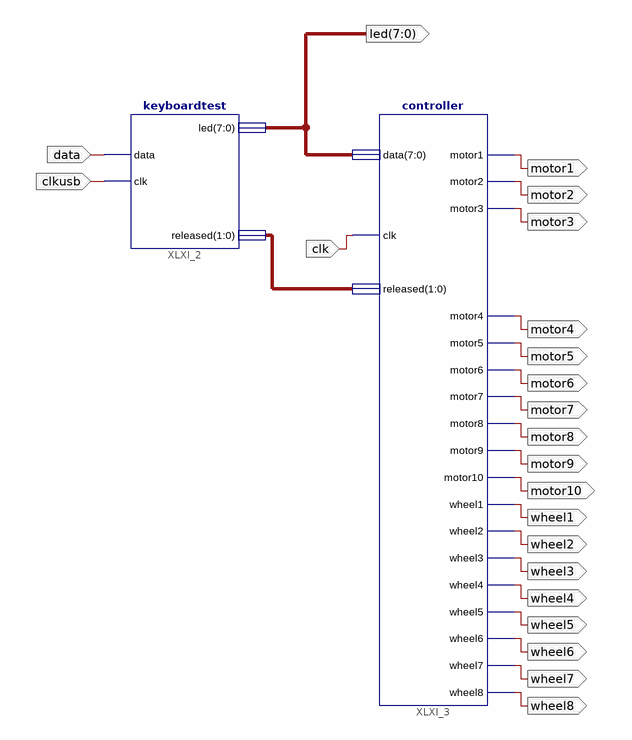
[diagram p0: schematic sheet 1]
// Xilinx ISE schematic motortop.sch (spartan6) as structural Verilog: 2 symbols, 22 ports
module motortop (
  input  clkusb,
  input  data,
  input  clk,
  output motor1,
  output motor2,
  output motor3,
  output motor4,
  output motor5,
  output motor6,
  output motor7,
  output motor8,
  output motor9,
  output motor10,
  output wheel1,
  output wheel2,
  output wheel3,
  output wheel4,
  output wheel5,
  output wheel6,
  output wheel7,
  output wheel8,
  output [7:0] led
);

  wire [1:0] XLXN_4;

  keyboardtest XLXI_2 (.clk(clkusb), .data(data), .led(led), .released(XLXN_4));
  controller XLXI_3 (
    .clk(clk), .data(led), .released(XLXN_4), .motor1(motor1), .motor2(motor2), .motor3(motor3),
    .motor4(motor4), .motor5(motor5), .motor6(motor6), .motor7(motor7), .motor8(motor8), .motor9(motor9),
    .motor10(motor10), .wheel1(wheel1), .wheel2(wheel2), .wheel3(wheel3), .wheel4(wheel4), .wheel5(wheel5),
    .wheel6(wheel6), .wheel7(wheel7), .wheel8(wheel8));
endmodule
